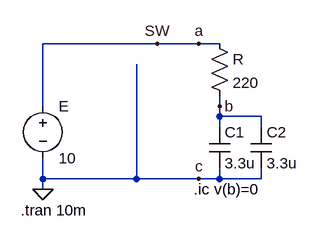
[diagram p0: schematic Draft12.asc]
Draft12.asc, the LTspice schematic file:
Version 4
SHEET 1 880 680
WIRE 224 48 48 48
WIRE 288 48 224 48
WIRE 320 48 288 48
WIRE 48 144 48 48
WIRE 320 144 320 128
WIRE 320 160 320 144
WIRE 384 160 320 160
WIRE 320 176 320 160
WIRE 384 176 384 160
WIRE 48 256 48 224
WIRE 192 256 192 80
WIRE 192 256 48 256
WIRE 288 256 192 256
WIRE 320 256 320 240
WIRE 320 256 288 256
WIRE 384 256 384 240
WIRE 384 256 320 256
WIRE 48 272 48 256
FLAG 224 48 SW
FLAG 288 48 a
FLAG 320 144 b
FLAG 288 256 c
FLAG 48 272 0
SYMBOL voltage 48 128 R0
WINDOW 123 0 0 Left 0
WINDOW 39 0 0 Left 0
SYMATTR InstName E
SYMATTR Value 10
SYMBOL res 304 32 R0
SYMATTR InstName R
SYMATTR Value 220
SYMATTR SpiceLine tol=1 pwr=0.1
SYMBOL cap 304 176 R0
SYMATTR InstName C1
SYMATTR Value 3.3u
SYMBOL cap 368 176 R0
SYMATTR InstName C2
SYMATTR Value 3.3u
TEXT 280 272 Left 2 !.ic v(b)=0
TEXT 14 304 Left 2 !.tran 10m

The netlist it stands for:
* Draft12.asc
V§E a 0 10
R a b 220 tol=1 pwr=0.1
C1 b 0 3.3u
C2 b 0 3.3u
.ic v(b)=0
.tran 10m
.backanno
.end

* Results of the author's LTspice run, read from the files saved beside the schematic
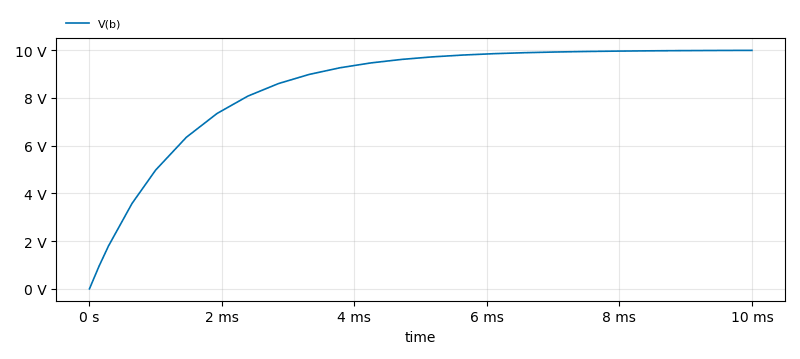
[diagram p1: Transient Analysis of Draft12.asc, plotted from the saved traces]
* Transient Analysis, 1 run:
*   V(b): min 0 V, max 9.99 V, average 8.541 V, rms 8.843 V, last 9.99 V